# EAGLE design Adafruit_ADS1115_16Bit_I2C_ADC_v2 (EAGLE 7.2.0)
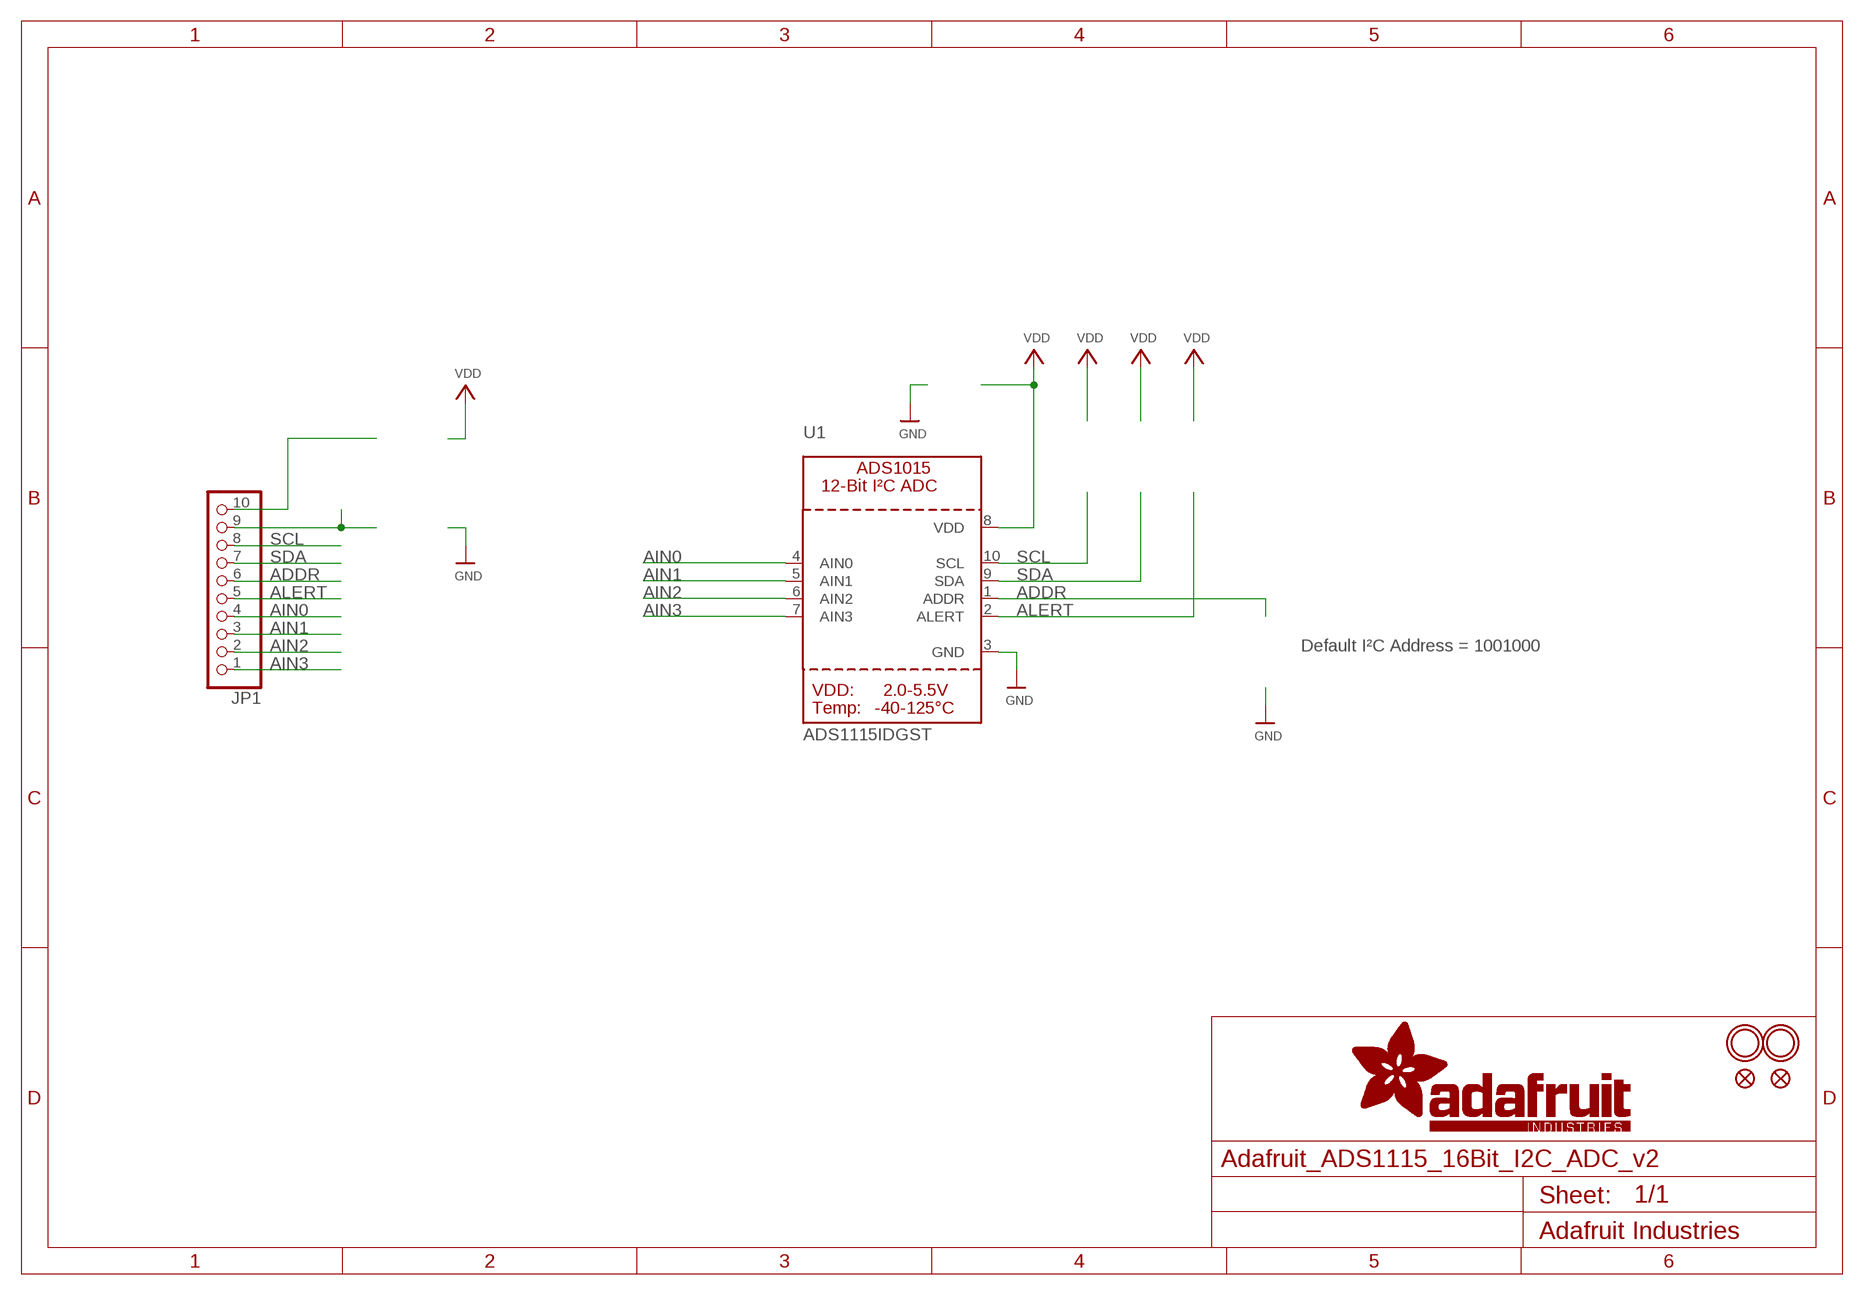
[diagram p0: schematic, sheet 1]

## Parts
FID1  FIDUCIAL""  [FIDUCIAL_1MM]
FID2  FIDUCIAL""  [FIDUCIAL_1MM]
JP1  HEADER-1X1070MIL  [1X10_ROUND70]
U1  ADS1115IDGST  ADC_ADS1015  [MSOP10]
U$13  MOUNTINGHOLE2.5  [MOUNTINGHOLE_2.5_PLATED]
U$14  MOUNTINGHOLE2.5  [MOUNTINGHOLE_2.5_PLATED]

## Nets
ADDR: JP1.6 U1.1(ADDR)
AIN0: JP1.4 U1.4(AIN0)
AIN1: JP1.3 U1.5(AIN1)
AIN2: JP1.2 U1.6(AIN2)
AIN3: JP1.1 U1.7(AIN3)
ALERT: JP1.5 U1.2(ALERT)
GND: U1.3(GND)
N$1: JP1.10
N$2: JP1.9
SCL: JP1.8 U1.10(SCL)
SDA: JP1.7 U1.9(SDA)
VDD: U1.8(VDD)

## Notes on the sheet
- Default I²C Address = 1001000

## Library data of the parts
FID1 FID2 = microbuilder:FIDUCIAL: Fiducial Alignment Points Various fiducial points for machine vision alignment.
JP1 = microbuilder:HEADER-1X10: PIN HEADER
U1 = microbuilder:ADC_ADS1015: ADS1015 - 12-bit 4-Channel I2C ADC with Internal PGA VDD: 2.0-5.5V Sampling Rate: 3.3ksps Gain Settings: 2/3, 1, 2, 4, 8, 16 I2C Address: ADDR low = 1001000x, ADDR high = 1001001x Internal Comparator The ADS1015 includes an internal comparator that can be set to output a high-level on ALERT when the conversion results exceeeds a pre-defined upper level, and will deassert itself when the level falls below a pre-defined lower threshold level. It can also be set to windowed mode where the ALERT pin will be asserted if the data exceeds the upper threshold or falls below the lower threshold.
U$13 U$14 = microbuilder:MOUNTINGHOLE: Mounting Hole For #2 screws (0.086"/2.18mm width, 0.094"/2.4mm hole) use 2.5mm

## Board
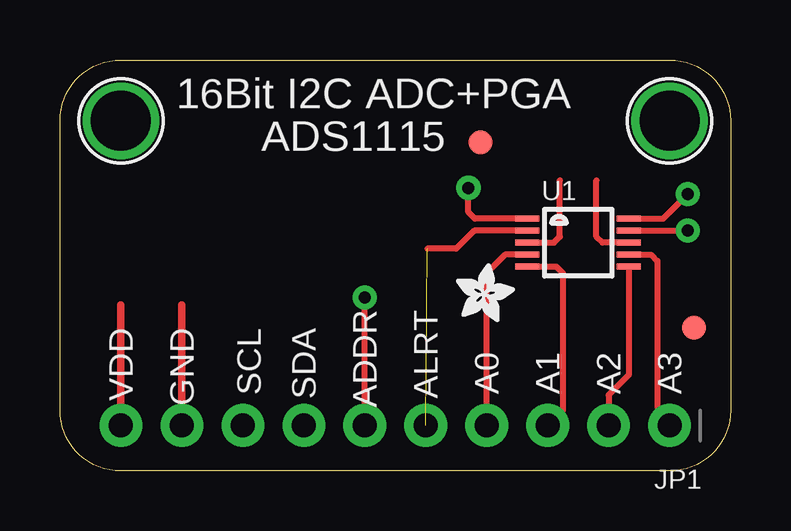
[diagram p1: board, top side]
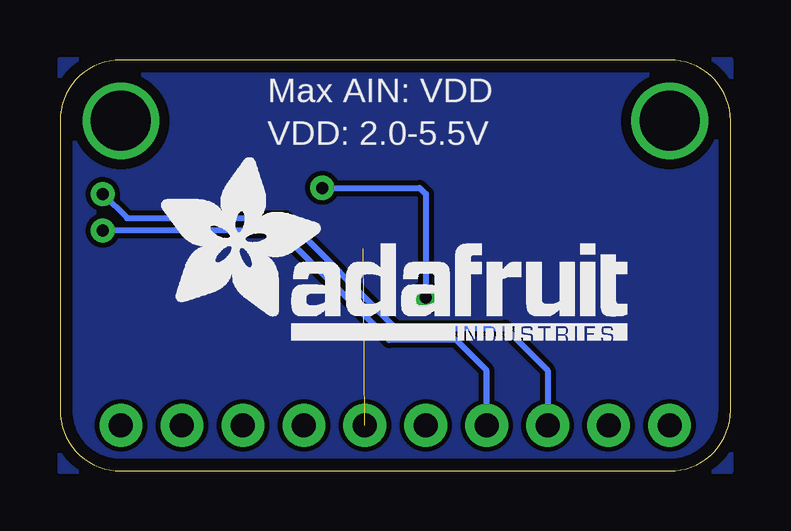
[diagram p2: board, bottom side, seen from below]

Size 27.94 x 17.14 mm. Coordinates in mm from the lower left corner, seen from the top.
Outline: 27.94,14.61 27.94,2.54 arc-90 25.4,0 2.54,0 arc-90 0,2.54 0,14.61 arc-90 2.54,17.14 25.4,17.14 arc-90 27.94,14.61
Copper layers (1*16): Top 0.035mm / dielectric 1.5mm / Bottom 0.035mm
Design rules "default": minimum track width 8mil, minimum drill 0.4mm, track to track 8mil, track to pad 8mil, pad to pad 8mil, via to via 8mil, smd to smd 8mil, copper to edge 20mil, drill to drill 8mil, minimum pad ring 8mil, minimum via ring 10mil, stop-mask expansion 3mil, vias tented up to drill 20mil, thermal gap 8mil

### Footprints (pad centres in the part's own frame; a part is rotated, then mirrored left to right if it is on the bottom)
FIDUCIAL_1MM = smd 1 x 1: 1 0,0
1X10_ROUND70 = drill 1 pad 1.778: 1 -11.43,0; 2 -8.89,0; 3 -6.35,0; 4 -3.81,0; 5 -1.27,0; 6 1.27,0; 7 3.81,0; 8 6.35,0; 9 8.89,0; 10 11.43,0
MSOP10 = smd 0.25 x 1: 1 -1,-2.113; 2 -0.5,-2.113; 3 0,-2.113; 4 0.5,-2.113; 5 1,-2.113; 6 1,2.113; 7 0.5,2.113; 8 0,2.113; 9 -0.5,2.113; 10 -1,2.113
MOUNTINGHOLE_2.5_PLATED = drill 2.5 pad 3.2: P$1 0,0

### Placement (x,y rotation side)
FID1  26.42,5.97 180 top
FID2  17.53,13.72 180 top
JP1  13.97,1.91 180 top
U1  21.59,9.53 270 top
U$13  25.4,14.61 180 top
U$14  2.54,14.61 180 top
U$15  [ADAFRUIT_TEXT_20MM]  23.88,5.46 0 bottom
U$16  [ADAFRUIT_2.5MM]  16.51,6.22 0 top

### Tracks (layer width: path | path; a pad name or v marks a point on that pad's centre or on a via)
ADDR  (via drill 0.5)
  Top 0.254: U1.1 17.29,10.53 17.02,10.79 v17.02,11.81 | JP1.6 v12.7,7.24
  Bottom 0.254: v17.02,11.81 12.95,11.81 12.7,11.56 v12.7,7.24
AIN0
  Top 0.254: U1.4 18.55,9.03 17.78,8.26 JP1.4
AIN1
  Top 0.254: U1.5 20.68,8.53 20.95,8.26 20.95,2.54 JP1.3
AIN2
  Top 0.254: U1.6 23.7,4.02 22.86,3.17 JP1.2
AIN3
  Top 0.254: U1.7 24.63,9.03 24.89,8.76 24.89,2.67 JP1.1
ALERT  (1 unrouted)
  Top 0.254: U1.2 17.26,10.03 16.51,9.27 15.31,9.27
GND
  Top 0.254: U1.3 20.57,9.53 20.83,9.78 20.83,12.13
  pour Bottom: 27.94,17.14 27.94,0 0,0 0,17.14
N$1
  Top 0.305: JP1.10 2.54,6.92
N$2
  Top 0.305: JP1.9 5.08,6.92
SCL  (via drill 0.5)
  Top 0.254: U1.10 25.13,10.53 v26.16,11.56
  Bottom 0.254: v26.16,11.56 25.15,10.54 18.54,10.54 13.97,5.97 9.4,5.97 7.62,4.19 JP1.8
SDA  (via drill 0.5)
  Top 0.254: U1.9 26.15,10.03 v26.16,10.03
  Bottom 0.254: JP1.7 10.16,4.19 11.43,5.46 14.22,5.46 18.8,10.03 v26.16,10.03
VDD
  Top 0.254: U1.8 22.61,9.53 22.35,9.78 22.35,12.13

### Text on the board
tPlace: 16Bit I2C ADC+PGA | ADS1115 | ADDR | ALRT | VDD | GND | SCL | SDA | A0 | A1 | A2 | A3
bPlace: Max AIN: VDD | VDD: 2.0-5.5V